# Altium schematic sheet MCU.SchDoc: MCU
size A3; DocumentNumber: MB1136; Revision: C.3; SheetNumber: 2; SheetTotal: 4; Project: NUCLEO-XXXXRX
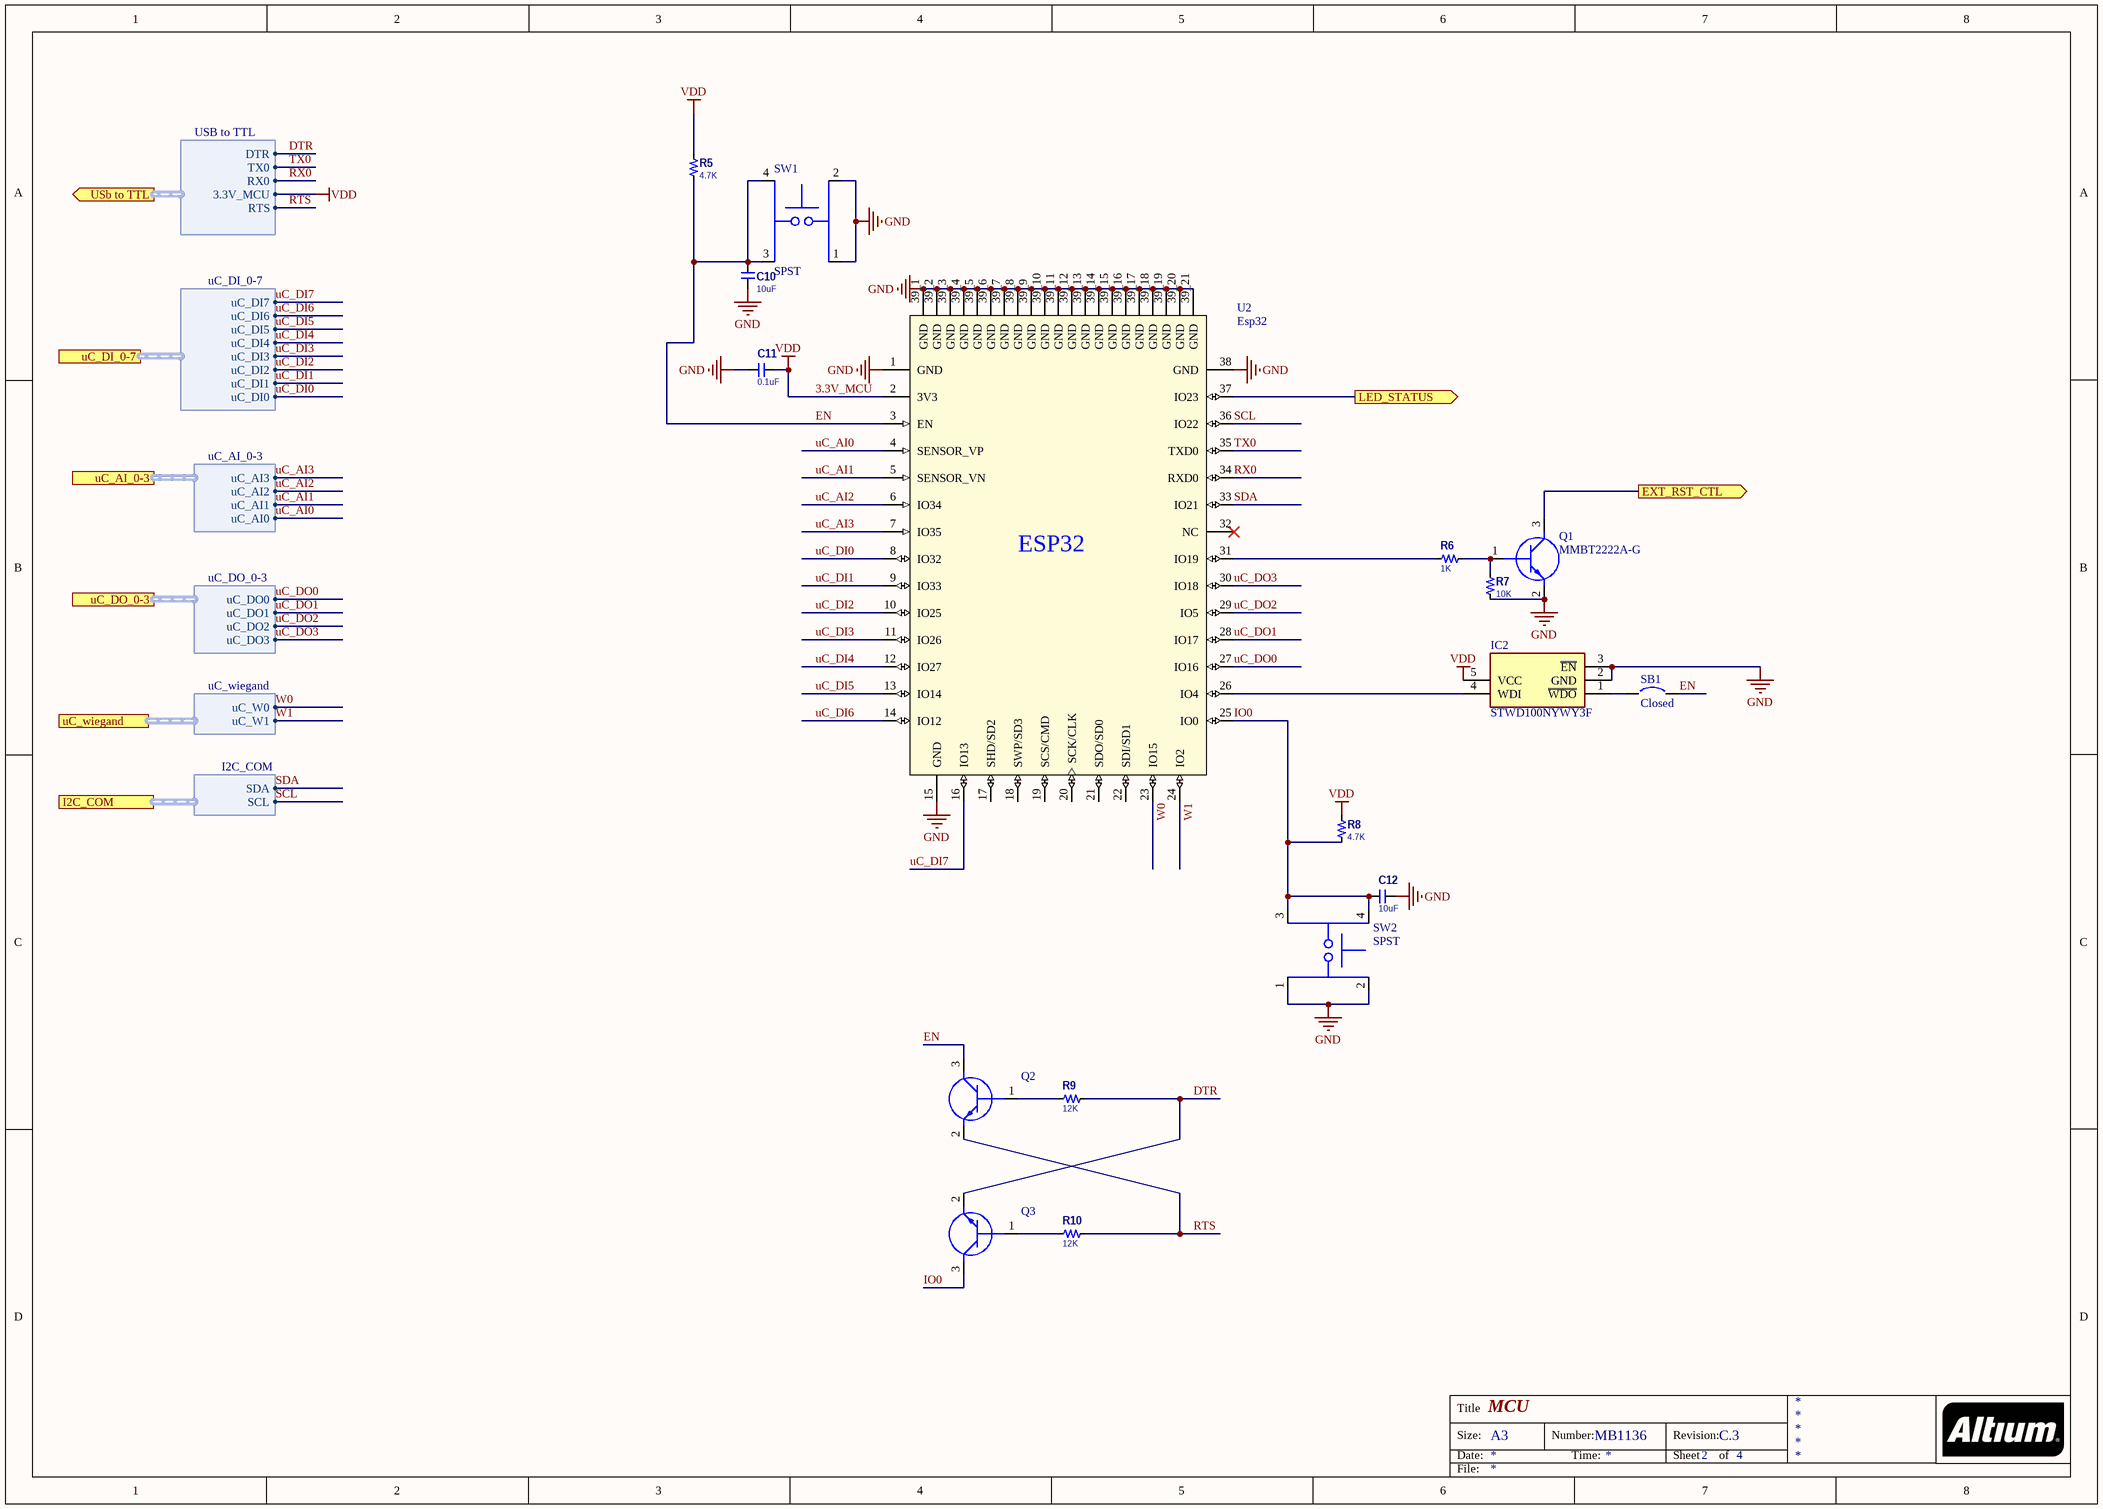
[diagram p0: MCU.SchDoc]

## Parts
C10  10uF  [0603-C]
C11  0.1uF  [0603-C]
C12  10uF  [0603-C]
IC2  STWD100NYWY3F  [SOT95P280X145-5N]
Q1  MMBT2222A-G  [SOT95P240X115-3N]
Q2  MMBT2222A-G  [SOT95P240X115-3N]  (value not drawn)
Q3  MMBT2222A-G  [SOT95P240X115-3N]  (value not drawn)
R5  4.7K  [0603-R]
R6  1K  [0603-R]
R7  10K  [0603-R]
R8  4.7K  [0603-R]
R9  12K  [0603-R]
R10  12K  [0603-R]
SB1  Closed  [SB_0603]
SW1  SPST  [TL3342F160QG]
SW2  SPST  [TL3342F160QG]
U2  Esp32  [MODULE_ESP32-WROOM-32]

## Ports
EXT_RST_CTL (out), I2C_COM (harness I2C_COM), LED_STATUS (out), uC_AI_0-3 (harness uC_AI_0-3), uC_DI_0-7 (harness uC_DI_0-7), uC_DO_0-3 (harness uC_DO_0-3), uC_wiegand (harness uC_wiegand), USb to TTL (out, harness USB to TTL)

## Harnesses
USB to TTL: TX0, RX0, DTR, RTS, 3.3V_MCU
uC_DI_0-7: uC_DI0, uC_DI1, uC_DI2, uC_DI3, uC_DI4, uC_DI5, uC_DI6, uC_DI7
uC_AI_0-3: uC_AI0, uC_AI1, uC_AI2, uC_AI3
uC_DO_0-3: uC_DO0, uC_DO1, uC_DO2, uC_DO3
uC_wiegand: uC_W0, uC_W1
I2C_COM: SDA, SCL

## Nets
3.3V_MCU: C11.2 IC2.5(VCC) R5.2 R8.2 U2.2(3V3) ; port USb to TTL.3.3V_MCU  [also labelled VDD]
GND: C10.2 C11.1 C12.2 IC2.2(GND) IC2.3(~{EN}) Q1.2(E) R7.1 SW1.1 SW1.2 SW2.1 SW2.2 U2.1(GND) U2.15(GND) U2.38(GND) U2.39_1(GND) U2.39_2(GND) U2.39_3(GND) U2.39_4(GND) U2.39_5(GND) U2.39_6(GND) U2.39_7(GND) U2.39_8(GND) U2.39_9(GND) U2.39_10(GND) U2.39_11(GND) U2.39_12(GND) U2.39_13(GND) U2.39_14(GND) U2.39_15(GND) U2.39_16(GND) U2.39_17(GND) U2.39_18(GND) U2.39_19(GND) U2.39_20(GND) U2.39_21(GND)
DTR: Q3.2(E) R9.1 ; port USb to TTL.DTR
EN: C10.1 Q2.3(C) R5.1 SB1.2 SW1.3 SW1.4 U2.3(EN)
EXT_RST_CTL: Q1.3(C) ; port EXT_RST_CTL
IO0: C12.1 Q3.3(C) R8.1 SW2.3 SW2.4 U2.25(IO0)
LED_STATUS: U2.37(IO23) ; port LED_STATUS
RTS: Q2.2(E) R10.1 ; port USb to TTL.RTS
RX0: U2.34(RXD0) ; port USb to TTL.RX0
SCL: U2.36(IO22) ; port I2C_COM.SCL
SDA: U2.33(IO21) ; port I2C_COM.SDA
TX0: U2.35(TXD0) ; port USb to TTL.TX0
uC_AI0: U2.4(SENSOR_VP) ; port uC_AI_0-3.uC_AI0
uC_AI1: U2.5(SENSOR_VN) ; port uC_AI_0-3.uC_AI1
uC_AI2: U2.6(IO34) ; port uC_AI_0-3.uC_AI2
uC_AI3: U2.7(IO35) ; port uC_AI_0-3.uC_AI3
uC_DI0: U2.8(IO32) ; port uC_DI_0-7.uC_DI0
uC_DI1: U2.9(IO33) ; port uC_DI_0-7.uC_DI1
uC_DI2: U2.10(IO25) ; port uC_DI_0-7.uC_DI2
uC_DI3: U2.11(IO26) ; port uC_DI_0-7.uC_DI3
uC_DI4: U2.12(IO27) ; port uC_DI_0-7.uC_DI4
uC_DI5: U2.13(IO14) ; port uC_DI_0-7.uC_DI5
uC_DI6: U2.14(IO12) ; port uC_DI_0-7.uC_DI6
uC_DI7: U2.16(IO13) ; port uC_DI_0-7.uC_DI7
uC_DO0: U2.27(IO16) ; port uC_DO_0-3.uC_DO0
uC_DO1: U2.28(IO17) ; port uC_DO_0-3.uC_DO1
uC_DO2: U2.29(IO5) ; port uC_DO_0-3.uC_DO2
uC_DO3: U2.30(IO18) ; port uC_DO_0-3.uC_DO3
W0: U2.23(IO15) ; port uC_wiegand.uC_W0
W1: U2.24(IO2) ; port uC_wiegand.uC_W1
NetIC2_1: IC2.1(~{WDO}) SB1.1
NetIC2_4: IC2.4(WDI) U2.26(IO4)
NetQ1_1: Q1.1(B) R6.1 R7.2
NetQ2_1: Q2.1(B) R9.2
NetQ3_1: Q3.1(B) R10.2
NetR6_2: R6.2 U2.31(IO19)

Not connected (* = marked no-connect by the designer): U2 17(SHD/SD2) 18(SWP/SD3) 19(SCS/CMD) 20(SCK/CLK) 21(SDO/SD0) 22(SDI/SD1) 32(NC)*

## Notes on the sheet
- Title
- Size:
- Date:
- A3
- Number:
- Time:
- Revision:
- Sheet
- of
- File:
- (in symbol ESP32-WROOM-32) ESP32

## Library data of the parts
C10-C12 = CAP: Manufacturer: TDK EPCOS; Manufacturer Part Number: B37941K9105K62; Capacitance: 1uF; Voltage Rating: 16V; Tolerance: 10%; ComponentLink1URL: https://datasheet.ciiva.com/13389/upy-gphc-y5v-6-3v-to-50v-5-13389978.pdf?src-supplier=Mouser; ComponentLink1Description: Datasheet; Supplier 1: Digi-Key; RoHS: Yes; Category: Ceramic Capacitors; Mount: Surface Mount; Case/Package: 0805; Case Code (Metric): 2012; Case Code (Imperial): 0805; Min Operating Temperature: -55°C; Max Operating Temperature: 125°C; Package Quantity: 3000; Packaging: Tape and Reel; Voltage Rating (DC): 16V; Length: 0.079inch; Width: 0.049inch; Height: 1.35mm; Thickness: 0.049inch; Ratings: AEC-Q200; Lead Free: Lead Free; ComponentLink2URL: http://components.arrow.com/part/dataview/0323_01879911?src-supplier=Arrow+Europe; ComponentLink2Description: http://components.arrow.com/part/dataview/0323_01879911?src-supplier=Arrow+Europe; ComponentLink3URL: https://media.digikey.com/pdf/Data%20Sheets/Epcos%20PDFs/B37872K_B37941K_Series.pdf?src-supplier=Digi-Key; ComponentLink3Description: https://media.digikey.com/pdf/Data%20Sheets/Epcos%20PDFs/B37872K_B37941K_Series.pdf?src-supplier=Digi-Key; Supplier Part Number 1: 495-1935-1-ND
IC2 = STWD100NYWY3F: Integrated Circuit; Manufacturer_Name: STMicroelectronics; Datasheet Link: https://datasheet.datasheetarchive.com/originals/distributors/Datasheets-DGA25/1683135.pdf; Height: 1.45mm; Manufacturer_Part_Number: STWD100NYWY3F; Mouser Part Number: 511-STWD100NYWY3F; Mouser Price/Stock: https://www.mouser.co.uk/ProductDetail/STMicroelectronics/STWD100NYWY3F?qs=jWm4idrLpzx15dHtESXwMQ%3D%3D; Arrow Part Number: STWD100NYWY3F; Arrow Price/Stock: https://www.arrow.com/en/products/stwd100nywy3f/stmicroelectronics?region=europe
Q1 Q3 = MMBT2222A-G: Transistor BJT NPN; Manufacturer_Name: Comchip Technology; Height: 1.15mm; Manufacturer_Part_Number: MMBT2222A-G; Mouser Part Number: 750-MMBT2222A-G; Mouser Price/Stock: https://www.mouser.co.uk/ProductDetail/Comchip-Technology/MMBT2222A-G?qs=2qJf6qQ4IOIM%2FSE9iCL8gQ%3D%3D; Arrow Part Number: MMBT2222A-G
  Q1: Datasheet Link: https://datasheet.datasheetarchive.com/originals/distributors/Datasheets-7/DSA-138996.pdf; Arrow Price/Stock: https://www.arrow.com/en/products/mmbt2222a-g/comchip-technology?region=nac
  Q3: Datasheet Link: http://www.comchiptech.com/admin/files/product/MMBT2222A-G%20RevB.pdf; Arrow Price/Stock: https://www.arrow.com/en/products/mmbt2222a-g/comchip-technology
Q2 = MMBT2222A-G_Mirror: Transistor BJT NPN; Manufacturer_Name: Comchip Technology; Datasheet Link: http://www.comchiptech.com/admin/files/product/MMBT2222A-G%20RevB.pdf; Height: 1.15mm; Manufacturer_Part_Number: MMBT2222A-G; Mouser Part Number: 750-MMBT2222A-G; Mouser Price/Stock: https://www.mouser.co.uk/ProductDetail/Comchip-Technology/MMBT2222A-G?qs=2qJf6qQ4IOIM%2FSE9iCL8gQ%3D%3D; Arrow Part Number: MMBT2222A-G; Arrow Price/Stock: https://www.arrow.com/en/products/mmbt2222a-g/comchip-technology
R5-R10 = Res_2: Manufacturer: Panasonic; Manufacturer Part Number: ERJ-8GEYJ621V; Resistance: 620R; Tolerance: 5%; Voltage Rating: 200V; Temperature Coefficient: 200ppm/°C; Max Power Dissipation: 250mW; ComponentLink1URL: https://datasheet.ciiva.com/15193/getdatasheetpartid-366470-15193725.pdf?src-supplier=Verical; ComponentLink1Description: Datasheet; Supplier 1: Avnet; Stock 1: 6255; Pricing 1: 1 = 0.01200 (USD); RoHS: Yes; Mount: Surface Mount; Case Code (Metric): 3216; Case Code (Imperial): 1206; Contact Plating: Tin; Min Operating Temperature: -55°C; Max Operating Temperature: 155°C; Packaging: Tape and Reel; Package Quantity: 1; Resistor Type: Thick Film; Number of Terminations: 2; Voltage Rating (DC): 200V; Features: Automotive AEC-Q200; Series: ERJ; Construction: Rectangular; Resistance Tolerance: 5%; Length: 3.2mm; Width: 0.063inch; Height: 0.028inch; Depth: 1.6mm; Radiation Hardening: No; REACH SVHC: No SVHC; Military Standard: Not; Lead Free: Lead Free; RoHS Compliant: Yes; ComponentLink2URL: https://datasheet.ciiva.com/46387/1500035-46387094.pdf?src-supplier=Element14; ComponentLink2Description: https://datasheet.ciiva.com/46387/1500035-46387094.pdf?src-supplier=Element14; ComponentLink3URL: https://datasheet.ciiva.com/5915/1500035-5915369.pdf?src-supplier=Farnell; ComponentLink3Description: https://datasheet.ciiva.com/5915/1500035-5915369.pdf?src-supplier=Farnell; ComponentLink4URL: https://datasheet.ciiva.com/28677/1678796-28677018.pdf?src-supplier=Element14; ComponentLink4Description: https://datasheet.ciiva.com/28677/1678796-28677018.pdf?src-supplier=Element14; ComponentLink5URL: https://datasheet.ciiva.com/17204/aoa0000ce1-17204972.pdf?src-supplier=Avnet+Europe; ComponentLink5Description: https://datasheet.ciiva.com/17204/aoa0000ce1-17204972.pdf?src-supplier=Avnet+Europe; ComponentLink6URL: https://datasheet.ciiva.com/16515/aoa0000ce1-16515933.pdf?src-supplier=Avnet+Asia; ComponentLink6Description: https://datasheet.ciiva.com/16515/aoa0000ce1-16515933.pdf?src-supplier=Avnet+Asia; Supplier Part Number 1: 65T8955; Power Rating: 250mW; Case/Package: 0603
SB1 = Circuit Breaker_close: Circuit Breaker; Published: 24-Mar-1999; Revision: July-2002: Re-released for DXP Platform.; Publisher: Altium Limited
SW1 SW2 = SWITCH TACTILE SPST-NO 0.05A 12V_EWP: E-SWITCH - TL3342F160QG - SWITCH, TACTILE, SPST-NO, 50mA, 12VDC; Manufacturer: SOFNG; Manufacturer Part Number: TS-1187-1816; Actuator Material: Polyphenylene; Mechanical Life: 100000Cycles; Switch Function: Off-Mom; Actuator Type: Standard; Illumination Type: Non-Illuminated; Operating Force: 160gf; Voltage Rating (DC): 12V; Actuator Length: 0.3mm; Supplier 1: Digi-Key; RoHS: Yes; Category: Tactile Switches; Stock 1: 9379; Pricing 1: 1=0.66000, 10=0.63500, 25=0.61120, 100=0.53040, 250=0.48396, 500=0.44974, 1000=0.40329 (USD); Mount: Surface Mount; Contact Plating: Silver; Contact Material: Silver; Throw Configuration: SPST; Packaging: Tape and Reel; Termination: Gull Wing; Current Rating: 50mA; Package Quantity: 3000; Series: TL3342; Orientation: Straight; Electrical Life: 100000Cycles; Max Voltage Rating (DC): 12V; Size: 5.2mm; RoHS Compliant: Yes; ComponentLink1URL: https://datasheet.lcsc.com/lcsc/1809012111_SOFNG-TS-1187-1816_C183614.pdf; ComponentLink1Description: https://datasheet.ciiva.com/2900/tl3342-2900822.pdf?src-supplier=Digi-Key; Supplier Part Number 1: EG2531CT-ND
U2 = ESP32-WROOM-32: Bluetooth, WiFi Transceiver Module 2.4GHz ~ 2.5GHz Surface Mount; MF: Espressif Systems; Package: Module Espressif Systems; Digi-Key_Part_Number: 1904-1010-1-ND; Digi-Key_Purchase_URL: https://www.digikey.com/product-detail/en/espressif-systems/ESP32-WROOM-32/1904-1010-1-ND/8544305?utm_source=snapeda&utm_medium=aggregator&utm_campaign=symbol; Value: *; MP: ESP32-WROOM-32; SnapEDA_Link: https://www.snapeda.com/parts/ESP32-WROOM-32/Espressif%20Systems/view-part/2753322/?ref=snap